# EAGLE design 8bitPig-PigstyGates_v2-frontPCB (EAGLE 9.2.2)
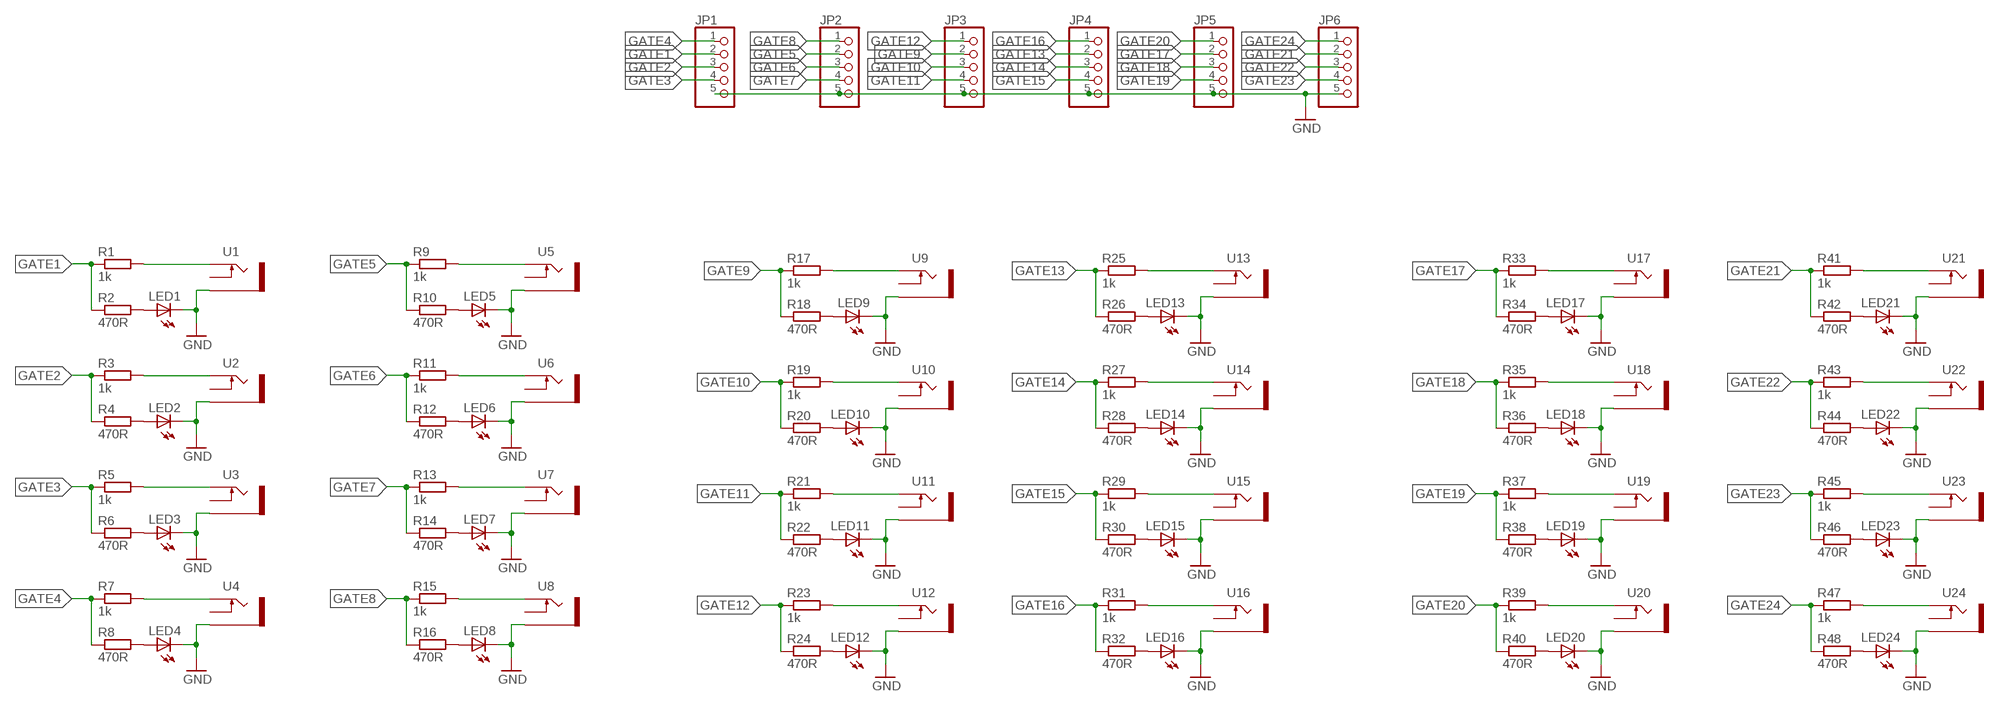
[diagram p0: schematic, sheet 1]

## Parts
JP1  PINHD-1X5  [1X05]
JP2  PINHD-1X5  [1X05]
JP3  PINHD-1X5  [1X05]
JP4  PINHD-1X5  [1X05]
JP5  PINHD-1X5  [1X05]
JP6  PINHD-1X5  [1X05]
LED1  LED3MM  [LED3MM]
LED2  LED3MM  [LED3MM]
LED3  LED3MM  [LED3MM]
LED4  LED3MM  [LED3MM]
LED5  LED3MM  [LED3MM]
LED6  LED3MM  [LED3MM]
LED7  LED3MM  [LED3MM]
LED8  LED3MM  [LED3MM]
LED9  LED3MM  [LED3MM]
LED10  LED3MM  [LED3MM]
LED11  LED3MM  [LED3MM]
LED12  LED3MM  [LED3MM]
LED13  LED3MM  [LED3MM]
LED14  LED3MM  [LED3MM]
LED15  LED3MM  [LED3MM]
LED16  LED3MM  [LED3MM]
LED17  LED3MM  [LED3MM]
LED18  LED3MM  [LED3MM]
LED19  LED3MM  [LED3MM]
LED20  LED3MM  [LED3MM]
LED21  LED3MM  [LED3MM]
LED22  LED3MM  [LED3MM]
LED23  LED3MM  [LED3MM]
LED24  LED3MM  [LED3MM]
R1  1k  R-EU_R0603  [R0603]
R2  470R  R-EU_R0603  [R0603]
R3  1k  R-EU_R0603  [R0603]
R4  470R  R-EU_R0603  [R0603]
R5  1k  R-EU_R0603  [R0603]
R6  470R  R-EU_R0603  [R0603]
R7  1k  R-EU_R0603  [R0603]
R8  470R  R-EU_R0603  [R0603]
R9  1k  R-EU_R0603  [R0603]
R10  470R  R-EU_R0603  [R0603]
R11  1k  R-EU_R0603  [R0603]
R12  470R  R-EU_R0603  [R0603]
R13  1k  R-EU_R0603  [R0603]
R14  470R  R-EU_R0603  [R0603]
R15  1k  R-EU_R0603  [R0603]
R16  470R  R-EU_R0603  [R0603]
R17  1k  R-EU_R0603  [R0603]
R18  470R  R-EU_R0603  [R0603]
R19  1k  R-EU_R0603  [R0603]
R20  470R  R-EU_R0603  [R0603]
R21  1k  R-EU_R0603  [R0603]
R22  470R  R-EU_R0603  [R0603]
R23  1k  R-EU_R0603  [R0603]
R24  470R  R-EU_R0603  [R0603]
R25  1k  R-EU_R0603  [R0603]
R26  470R  R-EU_R0603  [R0603]
R27  1k  R-EU_R0603  [R0603]
R28  470R  R-EU_R0603  [R0603]
R29  1k  R-EU_R0603  [R0603]
R30  470R  R-EU_R0603  [R0603]
R31  1k  R-EU_R0603  [R0603]
R32  470R  R-EU_R0603  [R0603]
R33  1k  R-EU_R0603  [R0603]
R34  470R  R-EU_R0603  [R0603]
R35  1k  R-EU_R0603  [R0603]
R36  470R  R-EU_R0603  [R0603]
R37  1k  R-EU_R0603  [R0603]
R38  470R  R-EU_R0603  [R0603]
R39  1k  R-EU_R0603  [R0603]
R40  470R  R-EU_R0603  [R0603]
R41  1k  R-EU_R0603  [R0603]
R42  470R  R-EU_R0603  [R0603]
R43  1k  R-EU_R0603  [R0603]
R44  470R  R-EU_R0603  [R0603]
R45  1k  R-EU_R0603  [R0603]
R46  470R  R-EU_R0603  [R0603]
R47  1k  R-EU_R0603  [R0603]
R48  470R  R-EU_R0603  [R0603]
U1  THONKICONNNEW  [WQP-PJ301M-12_JACK]
U2  THONKICONNNEW  [WQP-PJ301M-12_JACK]
U3  THONKICONNNEW  [WQP-PJ301M-12_JACK]
U4  THONKICONNNEW  [WQP-PJ301M-12_JACK]
U5  THONKICONNNEW  [WQP-PJ301M-12_JACK]
U6  THONKICONNNEW  [WQP-PJ301M-12_JACK]
U7  THONKICONNNEW  [WQP-PJ301M-12_JACK]
U8  THONKICONNNEW  [WQP-PJ301M-12_JACK]
U9  THONKICONNNEW  [WQP-PJ301M-12_JACK]
U10  THONKICONNNEW  [WQP-PJ301M-12_JACK]
U11  THONKICONNNEW  [WQP-PJ301M-12_JACK]
U12  THONKICONNNEW  [WQP-PJ301M-12_JACK]
U13  THONKICONNNEW  [WQP-PJ301M-12_JACK]
U14  THONKICONNNEW  [WQP-PJ301M-12_JACK]
U15  THONKICONNNEW  [WQP-PJ301M-12_JACK]
U16  THONKICONNNEW  [WQP-PJ301M-12_JACK]
U17  THONKICONNNEW  [WQP-PJ301M-12_JACK]
U18  THONKICONNNEW  [WQP-PJ301M-12_JACK]
U19  THONKICONNNEW  [WQP-PJ301M-12_JACK]
U20  THONKICONNNEW  [WQP-PJ301M-12_JACK]
U21  THONKICONNNEW  [WQP-PJ301M-12_JACK]
U22  THONKICONNNEW  [WQP-PJ301M-12_JACK]
U23  THONKICONNNEW  [WQP-PJ301M-12_JACK]
U24  THONKICONNNEW  [WQP-PJ301M-12_JACK]

## Nets
GATE1: JP1.2 R1.1 R2.1
GATE2: JP1.3 R3.1 R4.1
GATE3: JP1.4 R5.1 R6.1
GATE4: JP1.1 R7.1 R8.1
GATE5: JP2.2 R9.1 R10.1
GATE6: JP2.3 R11.1 R12.1
GATE7: JP2.4 R13.1 R14.1
GATE8: JP2.1 R15.1 R16.1
GATE9: JP3.2 R17.1 R18.1
GATE10: JP3.3 R19.1 R20.1
GATE11: JP3.4 R21.1 R22.1
GATE12: JP3.1 R23.1 R24.1
GATE13: JP4.2 R25.1 R26.1
GATE14: JP4.3 R27.1 R28.1
GATE15: JP4.4 R29.1 R30.1
GATE16: JP4.1 R31.1 R32.1
GATE17: JP5.2 R33.1 R34.1
GATE18: JP5.3 R35.1 R36.1
GATE19: JP5.4 R37.1 R38.1
GATE20: JP5.1 R39.1 R40.1
GATE21: JP6.2 R41.1 R42.1
GATE22: JP6.3 R43.1 R44.1
GATE23: JP6.4 R45.1 R46.1
GATE24: JP6.1 R47.1 R48.1
GND [pwr]: JP1.5 JP2.5 JP3.5 JP4.5 JP5.5 JP6.5 LED1.K(C) LED2.K(C) LED3.K(C) LED4.K(C) LED5.K(C) LED6.K(C) LED7.K(C) LED8.K(C) LED9.K(C) LED10.K(C) LED11.K(C) LED12.K(C) LED13.K(C) LED14.K(C) LED15.K(C) LED16.K(C) LED17.K(C) LED18.K(C) LED19.K(C) LED20.K(C) LED21.K(C) LED22.K(C) LED23.K(C) LED24.K(C) U1.P$3_SLEEVE(SLEEVE) U2.P$3_SLEEVE(SLEEVE) U3.P$3_SLEEVE(SLEEVE) U4.P$3_SLEEVE(SLEEVE) U5.P$3_SLEEVE(SLEEVE) U6.P$3_SLEEVE(SLEEVE) U7.P$3_SLEEVE(SLEEVE) U8.P$3_SLEEVE(SLEEVE) U9.P$3_SLEEVE(SLEEVE) U10.P$3_SLEEVE(SLEEVE) U11.P$3_SLEEVE(SLEEVE) U12.P$3_SLEEVE(SLEEVE) U13.P$3_SLEEVE(SLEEVE) U14.P$3_SLEEVE(SLEEVE) U15.P$3_SLEEVE(SLEEVE) U16.P$3_SLEEVE(SLEEVE) U17.P$3_SLEEVE(SLEEVE) U18.P$3_SLEEVE(SLEEVE) U19.P$3_SLEEVE(SLEEVE) U20.P$3_SLEEVE(SLEEVE) U21.P$3_SLEEVE(SLEEVE) U22.P$3_SLEEVE(SLEEVE) U23.P$3_SLEEVE(SLEEVE) U24.P$3_SLEEVE(SLEEVE)
N$1: LED1.A R2.2
N$2: R1.2 U1.P$1_TIP(TIP)
N$3: LED2.A R4.2
N$4: R3.2 U2.P$1_TIP(TIP)
N$5: LED3.A R6.2
N$6: R5.2 U3.P$1_TIP(TIP)
N$7: LED4.A R8.2
N$8: R7.2 U4.P$1_TIP(TIP)
N$9: LED5.A R10.2
N$10: R9.2 U5.P$1_TIP(TIP)
N$11: LED6.A R12.2
N$12: R11.2 U6.P$1_TIP(TIP)
N$13: LED7.A R14.2
N$14: R13.2 U7.P$1_TIP(TIP)
N$15: LED8.A R16.2
N$16: R15.2 U8.P$1_TIP(TIP)
N$17: LED9.A R18.2
N$18: R17.2 U9.P$1_TIP(TIP)
N$19: LED10.A R20.2
N$20: R19.2 U10.P$1_TIP(TIP)
N$21: LED11.A R22.2
N$22: R21.2 U11.P$1_TIP(TIP)
N$23: LED12.A R24.2
N$24: R23.2 U12.P$1_TIP(TIP)
N$25: LED13.A R26.2
N$26: R25.2 U13.P$1_TIP(TIP)
N$27: LED14.A R28.2
N$28: R27.2 U14.P$1_TIP(TIP)
N$29: LED15.A R30.2
N$30: R29.2 U15.P$1_TIP(TIP)
N$31: LED17.A R34.2
N$32: R33.2 U17.P$1_TIP(TIP)
N$33: LED16.A R32.2
N$34: R31.2 U16.P$1_TIP(TIP)
N$35: LED18.A R36.2
N$36: R35.2 U18.P$1_TIP(TIP)
N$37: LED19.A R38.2
N$38: R37.2 U19.P$1_TIP(TIP)
N$39: LED20.A R40.2
N$40: R39.2 U20.P$1_TIP(TIP)
N$41: LED21.A R42.2
N$42: R41.2 U21.P$1_TIP(TIP)
N$43: LED22.A R44.2
N$44: R43.2 U22.P$1_TIP(TIP)
N$45: LED23.A R46.2
N$46: R45.2 U23.P$1_TIP(TIP)
N$47: LED24.A R48.2
N$48: R47.2 U24.P$1_TIP(TIP)
Unconnected: U1.P$2_SWITCH(SWITCH) U2.P$2_SWITCH(SWITCH) U3.P$2_SWITCH(SWITCH) U4.P$2_SWITCH(SWITCH) U5.P$2_SWITCH(SWITCH) U6.P$2_SWITCH(SWITCH) U7.P$2_SWITCH(SWITCH) U8.P$2_SWITCH(SWITCH) U9.P$2_SWITCH(SWITCH) U10.P$2_SWITCH(SWITCH) U11.P$2_SWITCH(SWITCH) U12.P$2_SWITCH(SWITCH) U13.P$2_SWITCH(SWITCH) U14.P$2_SWITCH(SWITCH) U15.P$2_SWITCH(SWITCH) U16.P$2_SWITCH(SWITCH) U17.P$2_SWITCH(SWITCH) U18.P$2_SWITCH(SWITCH) U19.P$2_SWITCH(SWITCH) U20.P$2_SWITCH(SWITCH) U21.P$2_SWITCH(SWITCH) U22.P$2_SWITCH(SWITCH) U23.P$2_SWITCH(SWITCH) U24.P$2_SWITCH(SWITCH)

## Library data of the parts
JP1-JP6 = pinhead:PINHD-1X5: PIN HEADER
LED1-LED24 = led:LED: LED OSRAM: - CHIPLED LG R971, LG N971, LY N971, LG Q971, LY Q971, LO R971, LY R971 LH N974, LH R974 LS Q976, LO Q976, LY Q976 LO Q996 - Hyper CHIPLED LW Q18S LB Q993, LB Q99A, LB R99A - SideLED LS A670, LO A670, LY A670, LG A670, LP A670 LB A673, LV A673, LT A673, LW A673 LH A674 LY A675 LS A676, LA A676, LO A676, LY A676, LW A676 LS A679, LY A679, LG A679 - Hyper Micro SIDELED® LS Y876, LA Y876, LO Y876, LY Y876 LT Y87S - SmartLED LW L88C, LW L88S LB L89C, LB L89S, LG L890 LS L89K, LO L89K, LY L89K LS L896, LA L896, LO L896, LY L896 - TOPLED LS T670, LO T670, LY T670, LG T670, LP T670 LSG T670, LSP T670, LSY T670, LOP T670, LYG T670 LG T671, LOG T671, LSG T671 LB T673, LV T673, LT T673, LW T673 LH T674 LS T676, LA T676, LO T676, LY T676, LB T676, LH T676, LSB T676, LW T676 LB T67C, LV T67C, LT T67C, LS T67K, LO T67K, LY T67K, LW E67C LS E67B, LA E67B, LO E67B, LY E67B, LB E67C, LV E67C, LT E67C LW T67C LS T679, LY T679, LG T679 LS T770, LO T770, LY T770, LG T770, LP T770 LB T773, LV T773, LT T773, LW T773 LH T774 LS E675, LA E675, LY E675, LS T675 LS T776, LA T776, LO T776, LY T776, LB T776 LHGB T686 LT T68C, LB T68C - Hyper Mini TOPLED® LB M676 - Mini TOPLED Santana® LG M470 LS M47K, LO M47K, LY M47K Source: http://www.osram.convergy.de LUXEON: - LUMILED® LXK2-PW12-R00, LXK2-PW12-S00, LXK2-PW14-U00, LXK2-PW14-V00 LXK2-PM12-R00, LXK2-PM12-S00, LXK2-PM14-U00 LXK2-PE12-Q00, LXK2-PE12-R00, LXK2-PE12-S00, LXK2-PE14-T00, LXK2-PE14-U00 LXK2-PB12-K00, LXK2-PB12-L00, LXK2-PB12-M00, LXK2-PB14-N00, LXK2-PB14-P00, LXK2-PB14-Q00 LXK2-PR12-L00, LXK2-PR12-M00, LXK2-PR14-Q00, LXK2-PR14-R00 LXK2-PD12-Q00, LXK2-PD12-R00, LXK2-PD12-S00 LXK2-PH12-R00, LXK2-PH12-S00 LXK2-PL12-P00, LXK2-PL12-Q00, LXK2-PL12-R00 Source: www.luxeon.com KINGBRIGHT: KA-3528ASYC Source: www.kingbright.com
R1-R48 = resistor:R-EU_: RESISTOR, European symbol
U1-U24 = MusicThingModular:THONKICONN: 3.5mm socket for Eurorack modular synths

## Net classes
0 default: width 0.152 mm, clearance 0.305 mm
1 pwr: width 0.381 mm, clearance 0.508 mm
2 spi: width 0.152 mm, clearance 0.254 mm

## Board
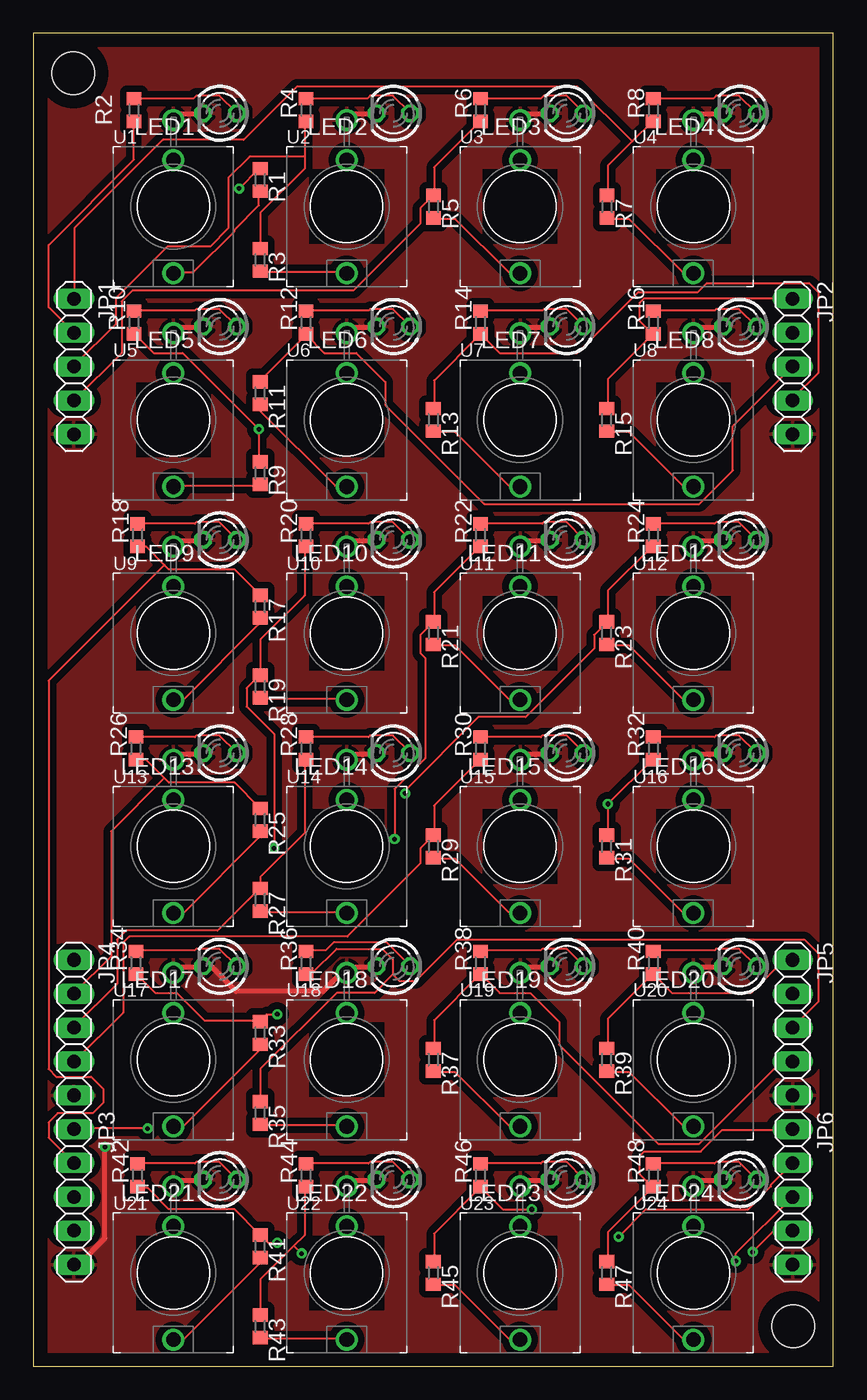
[diagram p1: board, top side]
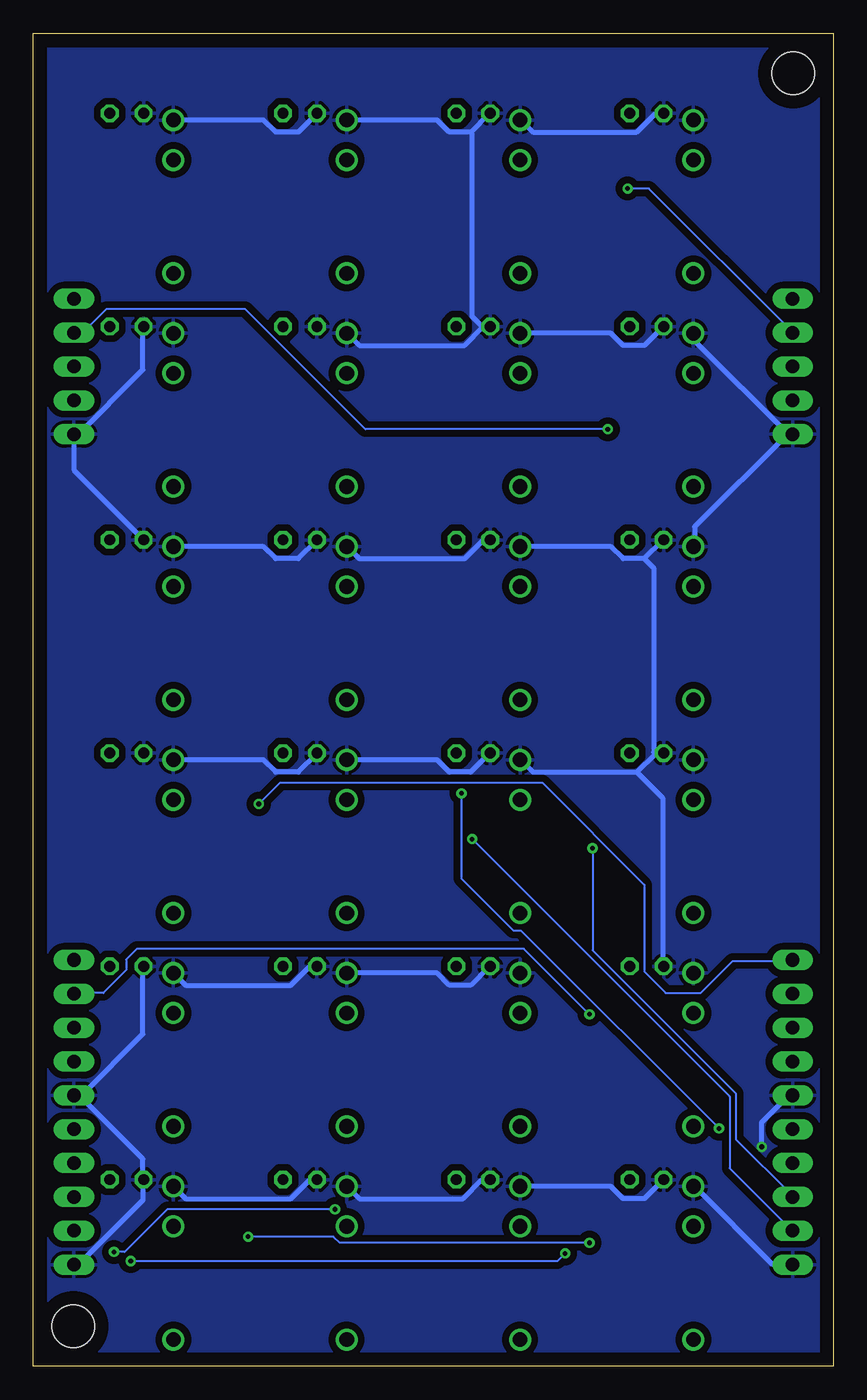
[diagram p2: board, bottom side, seen from below]

Size 60 x 100 mm. Coordinates in mm from the lower left corner, seen from the top.
Outline: 0,0 60,0 60,100 0,100 0,0
Copper layers (1*16): Top 0.035mm / dielectric 1.5mm / Bottom 0.035mm
Design rules "default": minimum track width 6mil, minimum drill 0.35mm, track to track 6mil, track to pad 6mil, pad to pad 6mil, via to via 6mil, smd to smd 6mil, copper to edge 40mil, drill to drill 6mil, minimum pad ring 10mil, minimum via ring 8mil, stop-mask expansion 4mil, vias tented up to drill 0mil, thermal gap 10mil
Holes 3.2 mm at 3,97 57,3

### Footprints (pad centres in the part's own frame; a part is rotated, then mirrored left to right if it is on the bottom)
1X05 = drill 1.016 long: 1 -5.08,0; 2 -2.54,0; 3 0,0; 4 2.54,0; 5 5.08,0
LED3MM = drill 0.813 octagon: A -1.27,0; K 1.27,0
R0603 = smd 1 x 1.1: 1 -0.85,0; 2 0.85,0
WQP-PJ301M-12_JACK = drill 1.1: P$1_TIP 0,5; P$2_SWITCH 0,-3.5; P$3_SLEEVE 0,-6.5

### Placement (x,y rotation side)
JP1  3.05,75 270 top
JP2  56.95,75 270 top
JP3  3.05,12.7 270 top
JP4  3.05,25.4 270 top
JP5  56.95,25.4 270 top
JP6  56.95,12.7 270 top
LED1  14,94 180 top
LED2  27,94 180 top
LED3  40,94 180 top
LED4  53,94 180 top
LED5  14,78 180 top
LED6  27,78 180 top
LED7  40,78 180 top
LED8  53,78 180 top
LED9  14,62 180 top
LED10  27,62 180 top
LED11  40,62 180 top
LED12  53,62 180 top
LED13  14,46 180 top
LED14  27,46 180 top
LED15  40,46 180 top
LED16  53,46 180 top
LED17  14,30 180 top
LED18  27,30 180 top
LED19  40,30 180 top
LED20  53,30 180 top
LED21  14,14 180 top
LED22  27,14 180 top
LED23  40,14 180 top
LED24  53,14 180 top
R1  17.02,89 270 top
R2  7.56,94.24 90 top
R3  17.02,83 270 top
R4  20.46,94.24 90 top
R5  30.02,87 270 top
R6  33.54,94.24 90 top
R7  43.03,87 270 top
R8  46.49,94.24 90 top
R9  17.02,67 270 top
R10  7.56,78.31 90 top
R11  17.02,73 270 top
R12  20.46,78.31 90 top
R13  30,71 270 top
R14  33.54,78.31 90 top
R15  43,71 270 top
R16  46.49,78.31 90 top
R17  17.02,57 270 top
R18  7.82,62.35 90 top
R19  17.02,51 270 top
R20  20.46,62.35 90 top
R21  30,55 270 top
R22  33.54,62.35 90 top
R23  43,55 270 top
R24  46.49,62.35 90 top
R25  17.02,41 270 top
R26  7.69,46.35 90 top
R27  17.02,35 270 top
R28  20.46,46.35 90 top
R29  30,39 270 top
R30  33.54,46.35 90 top
R31  43,39 270 top
R32  46.49,46.35 90 top
R33  17.02,25 270 top
R34  7.69,30.27 90 top
R35  17.02,19 270 top
R36  20.46,30.27 90 top
R37  30,23 270 top
R38  33.54,30.27 90 top
R39  43,23 270 top
R40  46.49,30.27 90 top
R41  17.02,9 270 top
R42  7.82,14.34 90 top
R43  17.02,3 270 top
R44  20.46,14.34 90 top
R45  30,7 270 top
R46  33.54,14.34 90 top
R47  43,7 270 top
R48  46.49,14.34 90 top
U1  10.5,87 180 top
U2  23.5,87 180 top
U3  36.5,87 180 top
U4  49.5,87 180 top
U5  10.5,71 180 top
U6  23.5,71 180 top
U7  36.5,71 180 top
U8  49.5,71 180 top
U9  10.5,55 180 top
U10  23.5,55 180 top
U11  36.5,55 180 top
U12  49.5,55 180 top
U13  10.5,39 180 top
U14  23.5,39 180 top
U15  36.5,39 180 top
U16  49.5,39 180 top
U17  10.5,23 180 top
U18  23.5,23 180 top
U19  36.5,23 180 top
U20  49.5,23 180 top
U21  10.5,7 180 top
U22  23.5,7 180 top
U23  36.5,7 180 top
U24  49.5,7 180 top

### Tracks (layer width: path | path; a pad name or v marks a point on that pad's centre or on a via)
GATE1  (via drill 0.35)
  Top 0.152: R2.1 7.54,93.38 7.54,90.53 1.14,84.12 1.14,79.44 2.97,77.61 JP1.2 | v15.43,88.35 16.92,89.84 R1.1
  Bottom 0.152: v15.43,88.35 13.83,88.35 3.09,77.61 JP1.2
GATE2
  Top 0.152: 20.34,90.75 20.34,93.38 R4.1 | 20.34,90.75 20.34,89.84 17.03,86.53 17.03,83.9 R3.1 | 20.34,90.75 16.23,90.75 14.63,89.15 14.63,85.38 13.26,84.01 10.06,84.01 6.17,80.12 6.17,78.18 3.09,75.09 JP1.3
GATE3
  Top 0.152: R6.1 33.49,93.38 30.06,89.95 30.06,87.9 R5.1 29.95,87.78 29.03,86.87 29.03,85.72 24,80.7 7.43,80.7 6.63,79.9 6.63,76.01 3.09,72.47 JP1.4
GATE4
  Top 0.152: 44.92,91.9 46.41,93.38 R8.1 | 44.92,91.9 43.09,90.07 43.09,87.9 R7.1 | 44.92,91.9 40.8,96.01 19.77,96.01 15.77,92.01 9.72,92.01 3.09,85.38 3.09,80.12 JP1.1
GATE5  (via drill 0.35)
  Top 0.152: R9.1 16.92,67.89 v16.92,70.29 11.2,76.01 9.03,76.01 7.66,77.38 R10.1
  Bottom 0.152: v16.92,70.29 35.09,70.29 44.12,79.32 54.52,79.32 56.24,77.61 56.92,77.61 JP2.2
GATE6
  Top 0.152: 20.46,77.38 17.03,73.95 R11.1 | 20.46,77.38 21.83,76.01 24.23,76.01 26.4,73.84 26.4,72.12 33.83,64.69 49.95,64.69 52.46,67.21 52.46,70.52 56.92,74.98 JP2.3 | 20.46,77.38 R12.1
GATE7
  Top 0.152: R13.1 30.06,71.89 30.06,73.95 33.49,77.38 R14.1 33.6,77.38 34.98,76.01 40.8,76.01 45.38,80.58 49.84,80.58 50.52,81.27 58.18,81.27 58.86,80.58 58.86,74.52 57.04,72.69 57.04,72.47 JP2.4
GATE8
  Top 0.152: R15.1 43.09,71.89 43.09,74.07 46.41,77.38 R16.1 46.41,77.5 45.49,78.41 45.49,79.78 45.83,80.12 56.92,80.12 JP2.1
GATE9
  Top 0.152: 9.83,60.12 10.17,59.78 15.09,59.78 16.92,57.95 R17.1 | 9.83,60.12 8.46,61.49 7.89,61.49 R18.1 | JP3.2 1.14,17.14 1.14,18.29 1.83,18.97 4.46,18.97 5.26,19.77 5.26,20.8 4.34,21.72 1.71,21.72 1.14,22.29 1.14,51.44 9.83,60.12
GATE10  (via drill 0.35)
  Top 0.152: R20.1 20.34,61.49 20.34,57.84 17.03,54.52 17.03,51.89 R19.1 16.92,51.78 16,50.86 16,49.49 18.06,47.43 v18.06,38.86
  Bottom 0.152: v18.06,38.86 18.06,31.2 7.32,20.46 7.32,17.03 3.09,12.8 JP3.3
GATE11  (via drill 0.35)
  Top 0.152: R22.1 33.49,61.49 30.06,58.06 30.06,55.89 R21.1 29.95,55.78 29.03,54.86 29.03,53.49 29.38,53.15 29.38,45.61 27.09,43.32 v27.09,39.55
  Bottom 0.152: v27.09,39.55 7.77,20.23 7.77,14.86 3.09,10.17 JP3.4
GATE12  (via drill 0.35)
  Top 0.152: R24.1 46.41,61.49 43.09,58.18 43.09,55.89 R23.1 42.98,55.78 42.06,54.86 42.06,53.84 36.92,48.69 33.38,48.69 27.89,43.2 v27.89,42.98 | v8.57,17.83 3.09,17.83 JP3.1
  Bottom 0.152: v8.57,17.83 23.43,32.69 24,32.69 27.89,36.58 v27.89,42.98
GATE13
  Top 0.152: 9.83,44.12 10.17,43.78 15.09,43.78 16.92,41.95 R25.1 | 9.83,44.12 8.46,45.49 7.77,45.49 R26.1 | 9.83,44.12 5.83,40.12 5.83,30.75 3.09,28 JP4.2
GATE14
  Top 0.152: R28.1 20.34,45.49 20.34,40.01 17.03,36.69 17.03,35.89 R27.1 16.92,35.78 13.83,32.69 6.97,32.69 6.29,32 6.29,28.69 3.09,25.49 JP4.3
GATE15
  Top 0.152: R30.1 33.49,45.49 30.06,42.06 30.06,39.89 R29.1 29.95,39.78 29.03,38.86 29.03,37.72 23.55,32.23 7.2,32.23 6.74,31.77 6.74,26.52 3.09,22.86 JP4.4
GATE16  (via drill 0.35)
  Top 0.152: R31.1 43.09,39.89 v43.09,42.18 46.41,45.49 R32.1
  Bottom 0.152: v43.09,42.18 41.49,43.78 21.83,43.78 14.17,36.12 14.17,29.6 12.57,28 9.94,28 7.54,30.4 3.09,30.4 JP4.1
GATE17  (via drill 0.35)
  Top 0.152: R34.1 7.77,29.38 9.14,28 10.74,28 12.8,25.95 16.92,25.95 R33.1 17.03,25.95 17.49,26.4 v18.29,26.4
  Bottom 0.152: v18.29,26.4 23.2,31.32 52.23,31.32 53.03,30.52 53.03,29.72 54.75,28 56.92,28 JP5.2
GATE18
  Top 0.152: 26.98,29.38 25.6,28 22.75,28 17.03,22.29 17.03,19.89 R35.1 | 26.98,29.38 26.98,30.52 26.18,31.32 22.75,31.32 20.92,29.49 20.46,29.49 R36.1 | 26.98,29.38 27.43,28.92 28.69,28.92 31.77,32 57.84,32 58.86,30.98 58.86,27.32 57.04,25.49 JP5.3
GATE19
  Top 0.152: R37.1 30.06,23.89 30.06,25.95 33.49,29.38 R38.1 33.6,29.38 34.98,28 37.26,28 39.43,25.83 39.43,24.12 46.86,16.69 49.95,16.69 56.12,22.86 JP5.4
GATE20
  Top 0.152: R39.1 43.09,23.89 43.09,26.06 46.41,29.38 R40.1 46.52,29.38 47.89,28 53.84,28 56.24,30.4 56.92,30.4 JP5.1
GATE21  (via drill 0.35)
  Top 0.152: R42.1 7.89,13.37 8.57,13.37 10.17,11.77 15.09,11.77 16.92,9.94 R41.1 17.03,9.83 17.6,9.26 v18.29,9.26 | v43.89,9.72 45.95,11.77 53.61,11.77 55.32,13.49 55.32,13.6 56.92,15.2 JP6.2
  Bottom 0.152: v43.89,9.72 37.49,9.72 37.03,9.26 v18.29,9.26
GATE22  (via drill 0.35)
  Top 0.152: 19.55,9.03 20.34,9.83 20.34,13.37 R44.1 | 19.55,9.03 17.03,6.51 17.03,3.89 R43.1 | v52.69,7.89 52.69,8.46 56.92,12.69 JP6.3 | 19.55,9.03 v20.12,8.46
  Bottom 0.152: v52.69,7.89 20.69,7.89 v20.12,8.46
GATE23  (via drill 0.35)
  Top 0.152: R45.1 30.06,7.89 30.06,9.94 33.49,13.37 R46.1 33.6,13.37 35.2,11.77 v37.38,11.77 | v53.95,8.57 55.44,10.06 56.92,10.06 JP6.4
  Bottom 0.152: v53.95,8.57 53.15,8.57 49.95,11.77 v37.38,11.77
GATE24
  Top 0.152: R47.1 43.09,7.89 43.09,10.06 46.41,13.37 R48.1 46.41,13.49 45.49,14.4 45.49,15.77 45.83,16.12 50.06,16.12 51.66,17.72 56.92,17.72 JP6.1
GND  (via drill 0.35)
  Top 0.381: LED22.K 25.72,13.95 23.89,13.95 23.55,13.6 U22.P$3_SLEEVE | LED23.K 38.63,13.95 36.92,13.95 36.58,13.6 U23.P$3_SLEEVE | LED21.K 12.69,13.95 10.86,13.95 10.52,13.6 U21.P$3_SLEEVE | v5.37,16.46 5.37,9.6 3.43,7.66 3.09,7.66 JP3.5 | LED19.K 38.63,29.95 36.92,29.95 36.58,29.6 U19.P$3_SLEEVE | U17.P$3_SLEEVE 10.52,29.6 10.86,29.95 12.69,29.95 LED17.K 12.92,29.95 13.37,29.95 15.2,28.12 21.72,28.12 23.09,29.49 23.32,29.49 U18.P$3_SLEEVE 23.55,29.6 23.89,29.95 25.72,29.95 LED18.K | LED20.K 51.66,29.95 49.95,29.95 49.61,29.6 U20.P$3_SLEEVE | LED24.K 51.66,13.95 49.95,13.95 49.61,13.6 U24.P$3_SLEEVE | LED4.K 51.66,93.95 49.95,93.95 49.61,93.61 U4.P$3_SLEEVE | LED3.K 38.63,93.95 36.92,93.95 36.58,93.61 U3.P$3_SLEEVE | LED1.K 12.69,93.95 10.86,93.95 10.52,93.61 U1.P$3_SLEEVE | LED2.K 25.72,93.95 23.89,93.95 23.55,93.61 U2.P$3_SLEEVE | LED16.K 51.66,45.95 49.95,45.95 49.61,45.61 U16.P$3_SLEEVE | LED15.K 38.63,45.95 36.92,45.95 36.58,45.61 U15.P$3_SLEEVE | LED13.K 12.69,45.95 10.86,45.95 10.52,45.61 U13.P$3_SLEEVE | LED14.K 25.72,45.95 23.89,45.95 23.55,45.61 U14.P$3_SLEEVE | LED8.K 51.66,77.95 49.95,77.95 49.61,77.61 U8.P$3_SLEEVE | LED12.K 51.66,61.95 49.95,61.95 49.61,61.61 U12.P$3_SLEEVE | LED6.K 25.72,77.95 23.89,77.95 23.55,77.61 U6.P$3_SLEEVE | LED7.K 38.63,77.95 36.92,77.95 36.58,77.61 U7.P$3_SLEEVE | LED10.K 25.72,61.95 23.89,61.95 23.55,61.61 U10.P$3_SLEEVE | LED11.K 38.63,61.95 36.92,61.95 36.58,61.61 U11.P$3_SLEEVE | LED9.K 12.69,61.95 10.86,61.95 10.52,61.61 U9.P$3_SLEEVE | LED5.K 12.69,77.95 10.86,77.95 10.52,77.61 U5.P$3_SLEEVE
  Bottom 0.381: LED22.K 25.83,13.95 26.4,13.95 27.77,12.57 35.55,12.57 36.46,13.49 U23.P$3_SLEEVE | JP3.5 3.09,7.66 4.57,7.66 10.4,13.49 U21.P$3_SLEEVE | v5.37,16.46 5.37,18.29 3.43,20.23 3.09,20.23 JP4.5 | U22.P$3_SLEEVE 23.43,13.49 16.69,13.49 15.77,12.57 14.17,12.57 12.8,13.95 LED21.K | U19.P$3_SLEEVE 36.46,29.49 29.72,29.49 28.8,28.57 27.2,28.57 25.83,29.95 LED18.K | JP6.5 56.92,7.66 56.58,7.66 51.78,12.46 51.78,13.95 LED24.K 51.78,14.17 51.78,15.54 56.46,20.23 56.92,20.23 JP5.5 56.35,20.34 51.78,24.92 51.78,29.95 LED20.K | LED19.K 38.75,29.95 39.32,29.95 40.69,28.57 48.58,28.57 U20.P$3_SLEEVE | LED23.K 38.75,13.95 39.32,13.95 40.69,12.57 48.58,12.57 49.49,13.49 U24.P$3_SLEEVE | LED1.K 12.8,93.95 13.37,93.95 14.74,92.58 22.52,92.58 23.43,93.5 U2.P$3_SLEEVE | 27.2,92.58 28.8,92.58 29.72,93.5 36.46,93.5 U3.P$3_SLEEVE | 27.2,92.58 25.83,93.95 LED2.K | U4.P$3_SLEEVE 42.75,93.5 41.83,92.58 40.12,92.58 38.75,93.95 LED3.K | 13.37,45.95 12.8,45.95 LED13.K | 14.74,44.58 13.37,45.95 | 14.74,44.58 22.52,44.58 23.43,45.49 U14.P$3_SLEEVE | U15.P$3_SLEEVE 36.46,45.49 29.72,45.49 28.8,44.58 27.2,44.58 25.83,45.95 LED14.K | U16.P$3_SLEEVE 42.75,45.49 41.83,44.58 40.12,44.58 38.75,45.95 LED15.K | LED12.K 51.78,62.06 56.92,67.21 56.92,69.84 JP2.5 56.81,69.72 51.78,74.75 51.78,77.95 LED8.K | 26.29,77.95 25.83,77.95 LED6.K | 26.29,77.95 27.66,76.58 35.55,76.58 36.46,77.5 U7.P$3_SLEEVE | LED10.K 25.83,61.95 26.29,61.95 27.66,60.58 35.55,60.58 36.46,61.49 U11.P$3_SLEEVE | U5.P$3_SLEEVE 10.4,77.5 10.4,76.92 3.43,69.95 3.09,69.95 JP1.5 3.54,69.84 10.4,62.98 10.4,61.61 U9.P$3_SLEEVE
  Bottom 0.381: 14.17,60.58 15.77,60.58 16.69,61.49 23.43,61.49 U10.P$3_SLEEVE | 14.17,60.58 12.8,61.95 LED9.K | U6.P$3_SLEEVE 23.43,77.5 16.69,77.5 15.77,76.58 14.17,76.58 12.8,77.95 LED5.K | U12.P$3_SLEEVE 42.75,61.49 41.83,60.58 40.12,60.58 38.75,61.95 LED11.K | 14.17,60.58 13.49,59.89 13.49,46.06 13.37,45.95 | 26.29,77.95 27.09,78.75 27.09,92.47 27.2,92.58 | 14.74,44.58 12.8,42.63 12.8,30.06 LED17.K
  pour Top: 1,99 59,99 59,1 1,1
  pour Bottom: 1,99 59,99 59,1 1,1
N$1
  Top 0.152: R2.2 7.66,95.1 12,95.1 12.23,95.33 13.95,95.33 15.2,94.07 LED1.A
N$2
  Top 0.152: R1.2 16.92,88.12 16.92,87.1 15.09,85.27 15.09,85.15 12,82.07 10.52,82.07 U1.P$1_TIP
N$3
  Top 0.152: R4.2 25.03,95.1 25.26,95.33 26.98,95.33 28.23,94.07 LED2.A
N$4
  Top 0.152: R3.2 17.03,82.07 23.43,82.07 U2.P$1_TIP
N$5
  Top 0.152: R6.2 33.6,95.1 38.06,95.1 38.29,95.33 40.01,95.33 41.26,94.07 LED3.A
N$6
  Top 0.152: R5.2 30.06,86.07 31.66,86.07 35.66,82.07 36.46,82.07 U3.P$1_TIP
N$7
  Top 0.152: R8.2 46.52,95.1 50.98,95.1 51.21,95.33 52.92,95.33 54.18,94.07 LED4.A
N$8
  Top 0.152: R7.2 43.09,86.07 44.69,86.07 48.69,82.07 49.49,82.07 U4.P$1_TIP
N$9
  Top 0.152: R10.2 7.66,79.21 12.12,79.21 12.23,79.32 13.95,79.32 15.2,78.07 LED5.A
N$10
  Top 0.152: R9.2 16.92,66.06 10.52,66.06 U5.P$1_TIP
N$11
  Top 0.152: R12.2 20.46,79.21 25.15,79.21 25.26,79.32 26.98,79.32 28.23,78.07 LED6.A
N$12
  Top 0.152: R11.2 17.03,72.12 17.03,71.67 22.63,66.06 23.43,66.06 U6.P$1_TIP
N$13
  Top 0.152: R14.2 33.6,79.21 38.18,79.21 38.29,79.32 40.01,79.32 41.26,78.07 LED7.A
N$14
  Top 0.152: R13.2 30.06,70.07 31.66,70.07 35.66,66.06 36.46,66.06 U7.P$1_TIP
N$15
  Top 0.152: R16.2 46.52,79.21 51.09,79.21 51.21,79.32 52.92,79.32 54.18,78.07 LED8.A
N$16
  Top 0.152: R15.2 43.09,70.07 44.69,70.07 48.69,66.06 49.49,66.06 U8.P$1_TIP
N$17
  Top 0.152: R18.2 7.89,63.21 12.12,63.21 12.23,63.32 13.95,63.32 15.2,62.06 LED9.A
N$18
  Top 0.152: R17.2 16.92,56.12 16.92,55.66 11.32,50.06 10.52,50.06 U9.P$1_TIP
N$19
  Top 0.152: R20.2 25.15,63.21 25.26,63.32 26.98,63.32 28.23,62.06 LED10.A
N$20
  Top 0.152: R19.2 17.03,50.06 23.43,50.06 U10.P$1_TIP
N$21
  Top 0.152: R22.2 33.6,63.21 38.18,63.21 38.29,63.32 40.01,63.32 41.26,62.06 LED11.A
N$22
  Top 0.152: R21.2 30.06,54.06 31.66,54.06 35.66,50.06 36.46,50.06 U11.P$1_TIP
N$23
  Top 0.152: R24.2 46.52,63.21 51.09,63.21 51.21,63.32 52.92,63.32 54.18,62.06 LED12.A
N$24
  Top 0.152: R23.2 43.09,54.06 44.69,54.06 48.69,50.06 49.49,50.06 U12.P$1_TIP
N$25
  Top 0.152: R26.2 7.77,47.21 12.12,47.21 12.23,47.32 13.95,47.32 15.2,46.06 LED13.A
N$26
  Top 0.152: R25.2 16.92,40.12 16.92,39.66 11.32,34.06 10.52,34.06 U13.P$1_TIP
N$27
  Top 0.152: R28.2 25.15,47.21 25.26,47.32 26.98,47.32 28.23,46.06 LED14.A
N$28
  Top 0.152: R27.2 17.03,34.06 23.43,34.06 U14.P$1_TIP
N$29
  Top 0.152: R30.2 33.6,47.21 38.06,47.21 38.18,47.32 40.01,47.32 41.26,46.06 LED15.A
N$30
  Top 0.152: R29.2 30.06,38.06 31.66,38.06 35.66,34.06 36.46,34.06 U15.P$1_TIP
N$31
  Top 0.152: R34.2 7.77,31.2 12.12,31.2 12.23,31.32 13.95,31.32 15.2,30.06 LED17.A
N$32
  Top 0.152: R33.2 16.92,24.12 16.92,23.66 11.32,18.06 10.52,18.06 U17.P$1_TIP
N$33
  Top 0.152: R32.2 46.52,47.21 51.09,47.21 51.21,47.32 52.92,47.32 54.18,46.06 LED16.A
N$34
  Top 0.152: R31.2 43.09,38.06 44.69,38.06 48.69,34.06 49.49,34.06 U16.P$1_TIP
N$35
  Top 0.152: R36.2 20.46,31.2 21.95,31.2 22.52,31.77 26.52,31.77 28.23,30.06 LED18.A
N$36
  Top 0.152: R35.2 17.03,18.06 23.43,18.06 U18.P$1_TIP
N$37
  Top 0.152: R38.2 33.6,31.2 38.06,31.2 38.18,31.32 40.01,31.32 41.26,30.06 LED19.A
N$38
  Top 0.152: R37.2 30.06,22.06 31.66,22.06 35.66,18.06 36.46,18.06 U19.P$1_TIP
N$39
  Top 0.152: R40.2 46.52,31.2 51.09,31.2 51.21,31.32 52.92,31.32 54.18,30.06 LED20.A
N$40
  Top 0.152: R39.2 43.09,22.06 44.69,22.06 48.69,18.06 49.49,18.06 U20.P$1_TIP
N$41
  Top 0.152: R42.2 7.89,15.2 12.12,15.2 12.23,15.32 13.95,15.32 15.2,14.06 LED21.A
N$42
  Top 0.152: R41.2 16.92,8.12 16.92,7.66 11.32,2.06 10.52,2.06 U21.P$1_TIP
N$43
  Top 0.152: R44.2 20.46,15.2 25.15,15.2 25.26,15.32 26.98,15.32 28.23,14.06 LED22.A
N$44
  Top 0.152: R43.2 17.03,2.06 23.43,2.06 U22.P$1_TIP
N$45
  Top 0.152: R46.2 33.6,15.2 38.06,15.2 38.18,15.32 40.01,15.32 41.26,14.06 LED23.A
N$46
  Top 0.152: R45.2 30.06,6.06 31.66,6.06 35.66,2.06 36.46,2.06 U23.P$1_TIP
N$47
  Top 0.152: R48.2 46.52,15.2 51.09,15.2 51.21,15.32 52.92,15.32 54.18,14.06 LED24.A
N$48
  Top 0.152: R47.2 43.09,6.06 44.69,6.06 48.69,2.06 49.49,2.06 U24.P$1_TIP